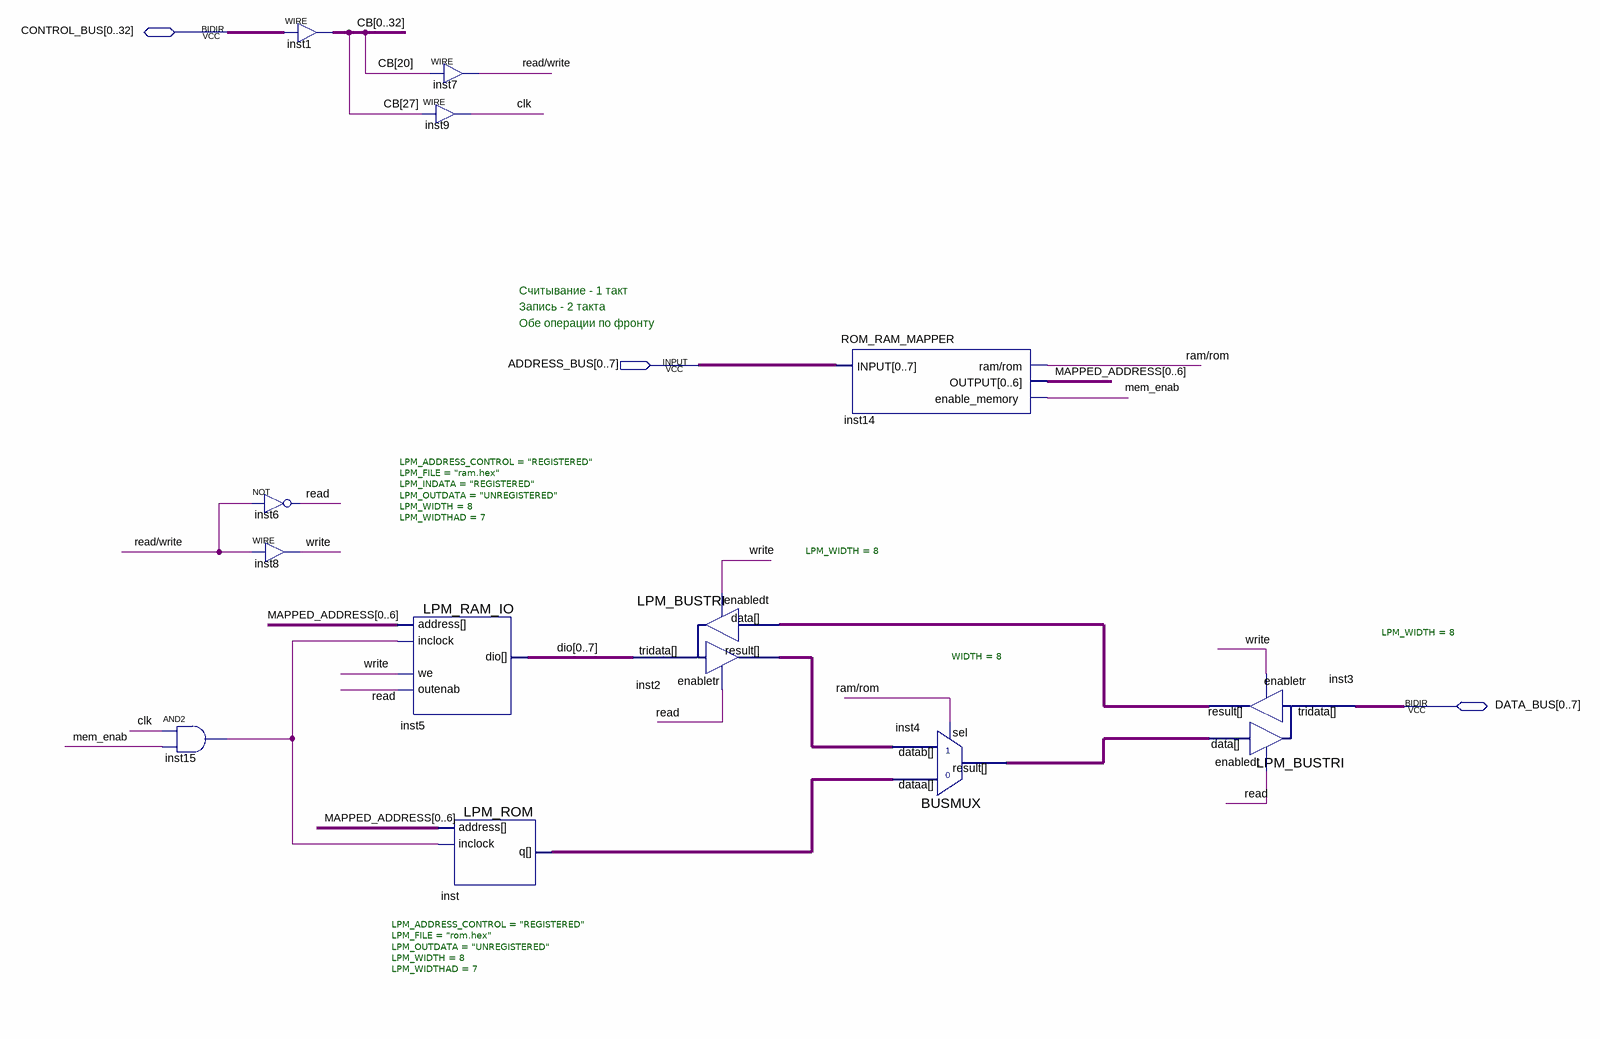
[diagram p0: schematic sheet]
// Quartus schematic MEMORY.bdf as structural Verilog: 12 symbols, 3 pins
module MEMORY (
  input  [0:7] ADDRESS_BUS,
  inout  [0:32] CONTROL_BUS,
  inout  [0:7] DATA_BUS
);

  wire clk, inst15_out, mem_enab, \ram/rom , read, \read/write , write;
  wire [6:0] MAPPED_ADDRESS;
  wire [7:0] dio, inst2_result, inst3_result, inst4_result, inst_q;
  wire [32:0] CB;

  and inst15 (inst15_out, clk, mem_enab);
  assign {CB[0], CB[1], CB[2], CB[3], CB[4], CB[5], CB[6], CB[7], CB[8], CB[9], CB[10], CB[11], CB[12], CB[13], CB[14], CB[15], CB[16], CB[17], CB[18], CB[19], CB[20], CB[21], CB[22], CB[23], CB[24], CB[25], CB[26], CB[27], CB[28], CB[29], CB[30], CB[31], CB[32]} = CONTROL_BUS;  // WIRE inst1
  not inst6 (read, \read/write );
  assign write = \read/write ;  // WIRE inst8
  assign \read/write  = CB[20];  // WIRE inst7
  assign clk = CB[27];  // WIRE inst9
  LPM_RAM_IO #(.LPM_ADDRESS_CONTROL("REGISTERED"), .LPM_FILE("ram.hex"), .LPM_INDATA("REGISTERED"), .LPM_OUTDATA("UNREGISTERED"), .LPM_WIDTH(8), .LPM_WIDTHAD(7)) inst5 (
    .address({MAPPED_ADDRESS[0], MAPPED_ADDRESS[1], MAPPED_ADDRESS[2], MAPPED_ADDRESS[3], MAPPED_ADDRESS[4], MAPPED_ADDRESS[5], MAPPED_ADDRESS[6]}),
    .inclock(inst15_out), .we(write), .outenab(read),
    .dio({dio[0], dio[1], dio[2], dio[3], dio[4], dio[5], dio[6], dio[7]}));
  LPM_ROM #(.LPM_ADDRESS_CONTROL("REGISTERED"), .LPM_FILE("rom.hex"), .LPM_OUTDATA("UNREGISTERED"), .LPM_WIDTH(8), .LPM_WIDTHAD(7)) inst (
    .address({MAPPED_ADDRESS[0], MAPPED_ADDRESS[1], MAPPED_ADDRESS[2], MAPPED_ADDRESS[3], MAPPED_ADDRESS[4], MAPPED_ADDRESS[5], MAPPED_ADDRESS[6]}),
    .inclock(inst15_out), .q(inst_q));
  LPM_BUSTRI #(.LPM_WIDTH(8)) inst2 (
    .data(inst3_result), .enabledt(write), .enabletr(read), .result(inst2_result),
    .tridata({dio[0], dio[1], dio[2], dio[3], dio[4], dio[5], dio[6], dio[7]}));
  ROM_RAM_MAPPER inst14 (
    .INPUT(ADDRESS_BUS), .\ram/rom (\ram/rom ),
    .OUTPUT({MAPPED_ADDRESS[0], MAPPED_ADDRESS[1], MAPPED_ADDRESS[2], MAPPED_ADDRESS[3], MAPPED_ADDRESS[4], MAPPED_ADDRESS[5], MAPPED_ADDRESS[6]}),
    .enable_memory(mem_enab));
  BUSMUX #(.WIDTH(8)) inst4 (.datab(inst2_result), .sel(\ram/rom ), .dataa(inst_q), .result(inst4_result));
  LPM_BUSTRI #(.LPM_WIDTH(8)) inst3 (
    .data(inst4_result), .enabledt(read), .enabletr(write), .result(inst3_result), .tridata(DATA_BUS));

  // Notes on the sheet:
  //   Считывание - 1 такт
  //   Запись - 2 такта
  //   Обе операции по фронту
endmodule
